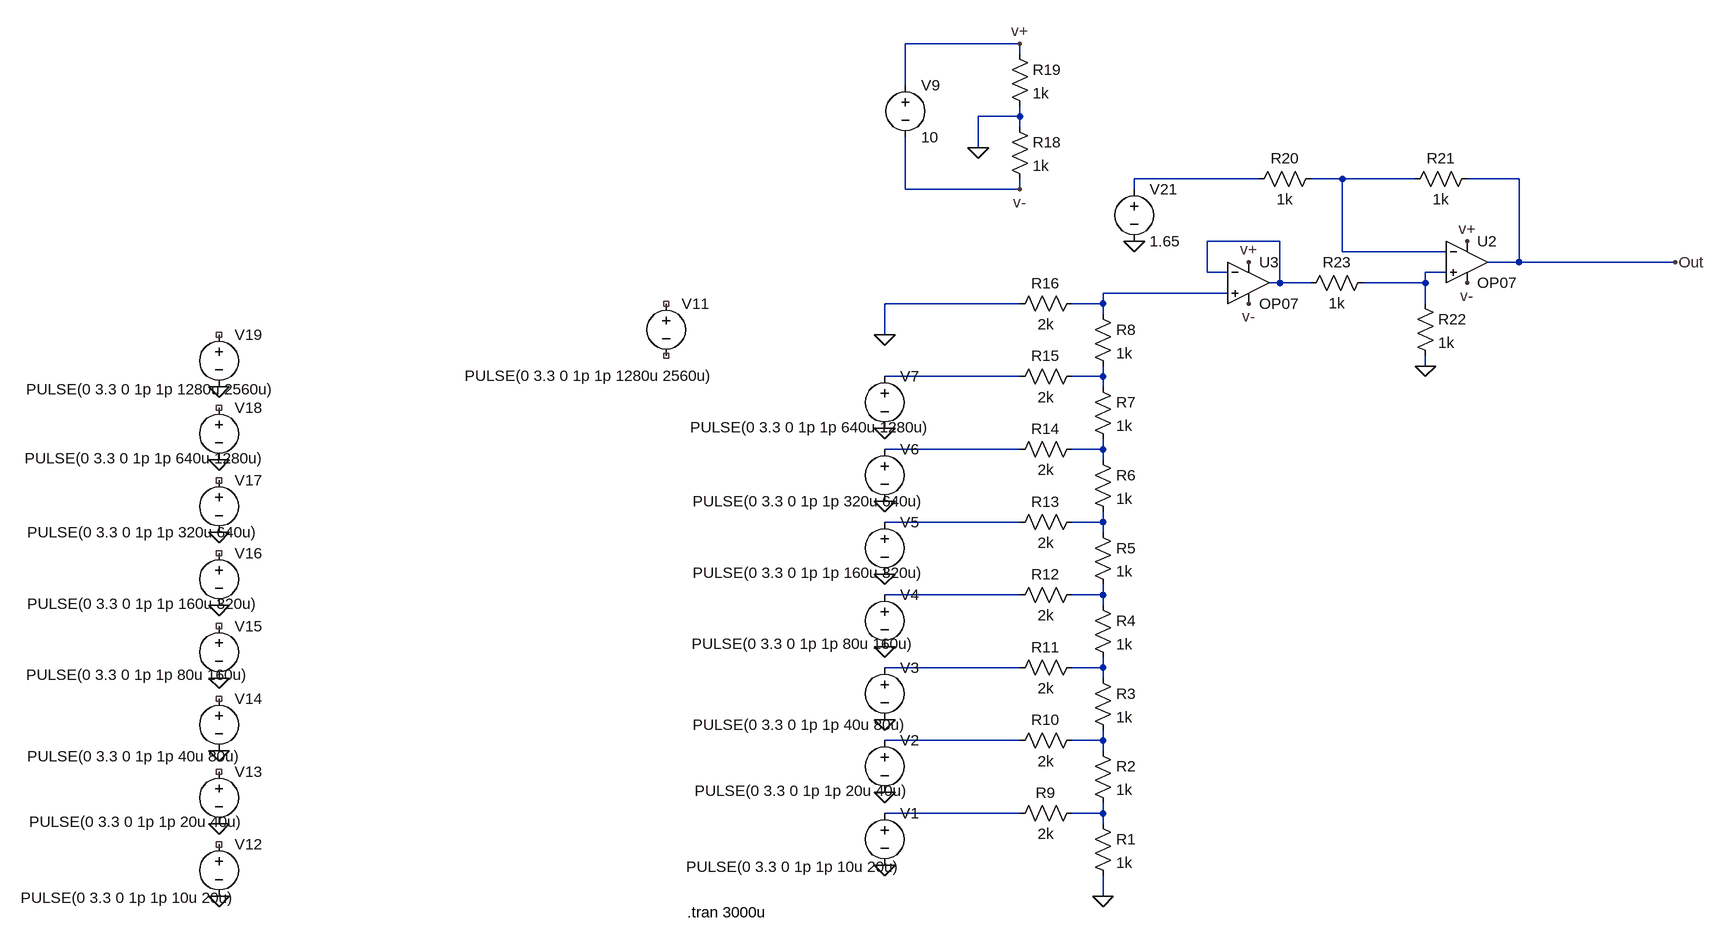
[diagram p0: schematic DAC.asc]
DAC.asc, the LTspice schematic file:
Version 4
SHEET 1 1316 680
WIRE -208 -1136 -384 -1136
WIRE -208 -1120 -208 -1136
WIRE -384 -1072 -384 -1136
WIRE -208 -1024 -208 -1040
WIRE -208 -1024 -272 -1024
WIRE -208 -1008 -208 -1024
WIRE -272 -976 -272 -1024
WIRE 160 -928 -32 -928
WIRE 288 -928 240 -928
WIRE 400 -928 288 -928
WIRE 560 -928 480 -928
WIRE -384 -912 -384 -992
WIRE -208 -912 -208 -928
WIRE -208 -912 -384 -912
WIRE -32 -912 -32 -928
WIRE 192 -832 80 -832
WIRE 288 -816 288 -928
WIRE 448 -816 288 -816
WIRE 560 -800 560 -928
WIRE 560 -800 512 -800
WIRE 800 -800 560 -800
WIRE 80 -784 80 -832
WIRE 112 -784 80 -784
WIRE 448 -784 416 -784
WIRE 192 -768 192 -832
WIRE 192 -768 176 -768
WIRE 240 -768 192 -768
WIRE 416 -768 416 -784
WIRE 416 -768 320 -768
WIRE 112 -752 -80 -752
WIRE -208 -736 -416 -736
WIRE -80 -736 -80 -752
WIRE -80 -736 -128 -736
WIRE 416 -736 416 -768
WIRE -80 -720 -80 -736
WIRE -416 -688 -416 -736
WIRE 416 -640 416 -656
WIRE -208 -624 -416 -624
WIRE -80 -624 -80 -640
WIRE -80 -624 -128 -624
WIRE -80 -608 -80 -624
WIRE -208 -512 -416 -512
WIRE -80 -512 -80 -528
WIRE -80 -512 -128 -512
WIRE -80 -496 -80 -512
WIRE -208 -400 -416 -400
WIRE -80 -400 -80 -416
WIRE -80 -400 -128 -400
WIRE -80 -384 -80 -400
WIRE -208 -288 -416 -288
WIRE -80 -288 -80 -304
WIRE -80 -288 -128 -288
WIRE -80 -272 -80 -288
WIRE -208 -176 -416 -176
WIRE -80 -176 -80 -192
WIRE -80 -176 -128 -176
WIRE -80 -160 -80 -176
WIRE -208 -64 -416 -64
WIRE -80 -64 -80 -80
WIRE -80 -64 -128 -64
WIRE -80 -48 -80 -64
WIRE -208 48 -416 48
WIRE -80 48 -80 32
WIRE -80 48 -128 48
WIRE -80 64 -80 48
WIRE -80 176 -80 144
FLAG -80 176 0
FLAG -208 -1136 v+
FLAG -208 -912 v-
FLAG -1440 176 0
FLAG -1440 64 0
FLAG -1440 -48 0
FLAG -1440 -160 0
FLAG -1440 -272 0
FLAG -1440 -384 0
FLAG -1440 -496 0
FLAG -1440 -608 0
FLAG -416 128 0
FLAG -416 16 0
FLAG -416 -96 0
FLAG -416 -208 0
FLAG -416 -320 0
FLAG -416 -432 0
FLAG -416 -544 0
FLAG 480 -832 v+
FLAG 480 -768 v-
FLAG 416 -640 0
FLAG -32 -832 0
FLAG 144 -800 v+
FLAG 144 -736 v-
FLAG -272 -976 0
FLAG 800 -800 Out
FLAG -416 -688 0
SYMBOL res -96 48 R0
SYMATTR InstName R1
SYMATTR Value 1k
SYMBOL res -96 -64 R0
SYMATTR InstName R2
SYMATTR Value 1k
SYMBOL res -96 -176 R0
SYMATTR InstName R3
SYMATTR Value 1k
SYMBOL res -96 -288 R0
SYMATTR InstName R4
SYMATTR Value 1k
SYMBOL res -96 -400 R0
SYMATTR InstName R5
SYMATTR Value 1k
SYMBOL res -96 -512 R0
SYMATTR InstName R6
SYMATTR Value 1k
SYMBOL res -96 -624 R0
SYMATTR InstName R7
SYMATTR Value 1k
SYMBOL res -96 -736 R0
SYMATTR InstName R8
SYMATTR Value 1k
SYMBOL res -112 32 R90
WINDOW 0 0 56 VBottom 2
WINDOW 3 32 56 VTop 2
SYMATTR InstName R9
SYMATTR Value 2k
SYMBOL res -112 -80 R90
WINDOW 0 0 56 VBottom 2
WINDOW 3 32 56 VTop 2
SYMATTR InstName R10
SYMATTR Value 2k
SYMBOL res -112 -192 R90
WINDOW 0 0 56 VBottom 2
WINDOW 3 32 56 VTop 2
SYMATTR InstName R11
SYMATTR Value 2k
SYMBOL res -112 -304 R90
WINDOW 0 0 56 VBottom 2
WINDOW 3 32 56 VTop 2
SYMATTR InstName R12
SYMATTR Value 2k
SYMBOL res -112 -416 R90
WINDOW 0 0 56 VBottom 2
WINDOW 3 32 56 VTop 2
SYMATTR InstName R13
SYMATTR Value 2k
SYMBOL res -112 -528 R90
WINDOW 0 0 56 VBottom 2
WINDOW 3 32 56 VTop 2
SYMATTR InstName R14
SYMATTR Value 2k
SYMBOL res -112 -640 R90
WINDOW 0 0 56 VBottom 2
WINDOW 3 32 56 VTop 2
SYMATTR InstName R15
SYMATTR Value 2k
SYMBOL res -112 -752 R90
WINDOW 0 0 56 VBottom 2
WINDOW 3 32 56 VTop 2
SYMATTR InstName R16
SYMATTR Value 2k
SYMBOL voltage -384 -1088 R0
WINDOW 123 0 0 Left 0
WINDOW 39 0 0 Left 0
SYMATTR InstName V9
SYMATTR Value 10
SYMBOL voltage -1440 80 R0
WINDOW 3 -305 98 Left 2
WINDOW 123 0 0 Left 0
WINDOW 39 0 0 Left 0
SYMATTR Value PULSE(0 3.3 0 1p 1p 10u 20u)
SYMATTR InstName V12
SYMBOL voltage -1440 -32 R0
WINDOW 3 -292 93 Left 2
WINDOW 123 0 0 Left 0
WINDOW 39 0 0 Left 0
SYMATTR Value PULSE(0 3.3 0 1p 1p 20u 40u)
SYMATTR InstName V13
SYMBOL voltage -1440 -144 R0
WINDOW 3 -295 104 Left 2
WINDOW 123 0 0 Left 0
WINDOW 39 0 0 Left 0
SYMATTR Value PULSE(0 3.3 0 1p 1p 40u 80u)
SYMATTR InstName V14
SYMBOL voltage -1440 -256 R0
WINDOW 3 -297 91 Left 2
WINDOW 123 0 0 Left 0
WINDOW 39 0 0 Left 0
SYMATTR Value PULSE(0 3.3 0 1p 1p 80u 160u)
SYMATTR InstName V15
SYMBOL voltage -1440 -368 R0
WINDOW 3 -295 94 Left 2
WINDOW 123 0 0 Left 0
WINDOW 39 0 0 Left 0
SYMATTR Value PULSE(0 3.3 0 1p 1p 160u 320u)
SYMATTR InstName V16
SYMBOL voltage -1440 -480 R0
WINDOW 3 -295 96 Left 2
WINDOW 123 0 0 Left 0
WINDOW 39 0 0 Left 0
SYMATTR Value PULSE(0 3.3 0 1p 1p 320u 640u)
SYMATTR InstName V17
SYMBOL voltage -1440 -592 R0
WINDOW 3 -299 94 Left 2
WINDOW 123 0 0 Left 0
WINDOW 39 0 0 Left 0
SYMATTR Value PULSE(0 3.3 0 1p 1p 640u 1280u)
SYMATTR InstName V18
SYMBOL voltage -1440 -704 R0
WINDOW 3 -297 100 Left 2
WINDOW 123 0 0 Left 0
WINDOW 39 0 0 Left 0
SYMATTR Value PULSE(0 3.3 0 1p 1p 1280u 2560u)
SYMATTR InstName V19
SYMBOL voltage -416 32 R0
WINDOW 3 -305 98 Left 2
WINDOW 123 0 0 Left 0
WINDOW 39 0 0 Left 0
SYMATTR Value PULSE(0 3.3 0 1p 1p 10u 20u)
SYMATTR InstName V1
SYMBOL voltage -416 -80 R0
WINDOW 3 -292 93 Left 2
WINDOW 123 0 0 Left 0
WINDOW 39 0 0 Left 0
SYMATTR Value PULSE(0 3.3 0 1p 1p 20u 40u)
SYMATTR InstName V2
SYMBOL voltage -416 -192 R0
WINDOW 3 -295 104 Left 2
WINDOW 123 0 0 Left 0
WINDOW 39 0 0 Left 0
SYMATTR Value PULSE(0 3.3 0 1p 1p 40u 80u)
SYMATTR InstName V3
SYMBOL voltage -416 -304 R0
WINDOW 3 -297 91 Left 2
WINDOW 123 0 0 Left 0
WINDOW 39 0 0 Left 0
SYMATTR Value PULSE(0 3.3 0 1p 1p 80u 160u)
SYMATTR InstName V4
SYMBOL voltage -416 -416 R0
WINDOW 3 -295 94 Left 2
WINDOW 123 0 0 Left 0
WINDOW 39 0 0 Left 0
SYMATTR Value PULSE(0 3.3 0 1p 1p 160u 320u)
SYMATTR InstName V5
SYMBOL voltage -416 -528 R0
WINDOW 3 -295 96 Left 2
WINDOW 123 0 0 Left 0
WINDOW 39 0 0 Left 0
SYMATTR Value PULSE(0 3.3 0 1p 1p 320u 640u)
SYMATTR InstName V6
SYMBOL voltage -416 -640 R0
WINDOW 3 -299 94 Left 2
WINDOW 123 0 0 Left 0
WINDOW 39 0 0 Left 0
SYMATTR Value PULSE(0 3.3 0 1p 1p 640u 1280u)
SYMATTR InstName V7
SYMBOL OpAmps\\OP07 480 -864 R0
SYMATTR InstName U2
SYMBOL res 256 -944 R90
WINDOW 0 0 56 VBottom 2
WINDOW 3 32 56 VTop 2
SYMATTR InstName R20
SYMATTR Value 1k
SYMBOL res 496 -944 R90
WINDOW 0 0 56 VBottom 2
WINDOW 3 32 56 VTop 2
SYMATTR InstName R21
SYMATTR Value 1k
SYMBOL res 400 -752 R0
SYMATTR InstName R22
SYMATTR Value 1k
SYMBOL res 336 -784 R90
WINDOW 0 0 56 VBottom 2
WINDOW 3 32 56 VTop 2
SYMATTR InstName R23
SYMATTR Value 1k
SYMBOL voltage -32 -928 R0
WINDOW 123 0 0 Left 0
WINDOW 39 0 0 Left 0
SYMATTR InstName V21
SYMATTR Value 1.65
SYMBOL voltage -752 -752 R0
WINDOW 3 -310 127 Left 2
WINDOW 123 0 0 Left 0
WINDOW 39 0 0 Left 0
SYMATTR Value PULSE(0 3.3 0 1p 1p 1280u 2560u)
SYMATTR InstName V11
SYMBOL OpAmps\\OP07 144 -832 R0
SYMATTR InstName U3
SYMBOL res -224 -1024 R0
SYMATTR InstName R18
SYMATTR Value 1k
SYMBOL res -224 -1136 R0
SYMATTR InstName R19
SYMATTR Value 1k
TEXT -720 200 Left 2 !.tran 3000u

The netlist it stands for:
* DAC.asc
R1 N019 0 1k
R2 N017 N019 1k
R3 N015 N017 1k
R4 N013 N015 1k
R5 N011 N013 1k
R6 N009 N011 1k
R7 N007 N009 1k
R8 N005 N007 1k
R9 N019 N018 2k
R10 N017 N016 2k
R11 N015 N014 2k
R12 N013 N012 2k
R13 N011 N010 2k
R14 N009 N008 2k
R15 N007 N006 2k
R16 N005 0 2k
V9 v+ v- 10
V12 NC_01 0 PULSE(0 3.3 0 1p 1p 10u 20u)
V13 NC_02 0 PULSE(0 3.3 0 1p 1p 20u 40u)
V14 NC_03 0 PULSE(0 3.3 0 1p 1p 40u 80u)
V15 NC_04 0 PULSE(0 3.3 0 1p 1p 80u 160u)
V16 NC_05 0 PULSE(0 3.3 0 1p 1p 160u 320u)
V17 NC_06 0 PULSE(0 3.3 0 1p 1p 320u 640u)
V18 NC_07 0 PULSE(0 3.3 0 1p 1p 640u 1280u)
V19 NC_08 0 PULSE(0 3.3 0 1p 1p 1280u 2560u)
V1 N018 0 PULSE(0 3.3 0 1p 1p 10u 20u)
V2 N016 0 PULSE(0 3.3 0 1p 1p 20u 40u)
V3 N014 0 PULSE(0 3.3 0 1p 1p 40u 80u)
V4 N012 0 PULSE(0 3.3 0 1p 1p 80u 160u)
V5 N010 0 PULSE(0 3.3 0 1p 1p 160u 320u)
V6 N008 0 PULSE(0 3.3 0 1p 1p 320u 640u)
V7 N006 0 PULSE(0 3.3 0 1p 1p 640u 1280u)
XU2 N004 N002 v+ v- Out LT1001  ; OP07, pins In+ In- V+ V- OUT
R20 N002 N001 1k
R21 Out N002 1k
R22 N004 0 1k
R23 N004 N003 1k
V21 N001 0 1.65
V11 NC_09 NC_10 PULSE(0 3.3 0 1p 1p 1280u 2560u)
XU3 N005 N003 v+ v- N003 LT1001  ; OP07, pins In+ In- V+ V- OUT
R18 0 v- 1k
R19 v+ 0 1k
.tran 3000u
.lib LTC.lib
.backanno
.end